# Altium schematic sheet 02_USB2UART.SchDoc
size OrCAD B
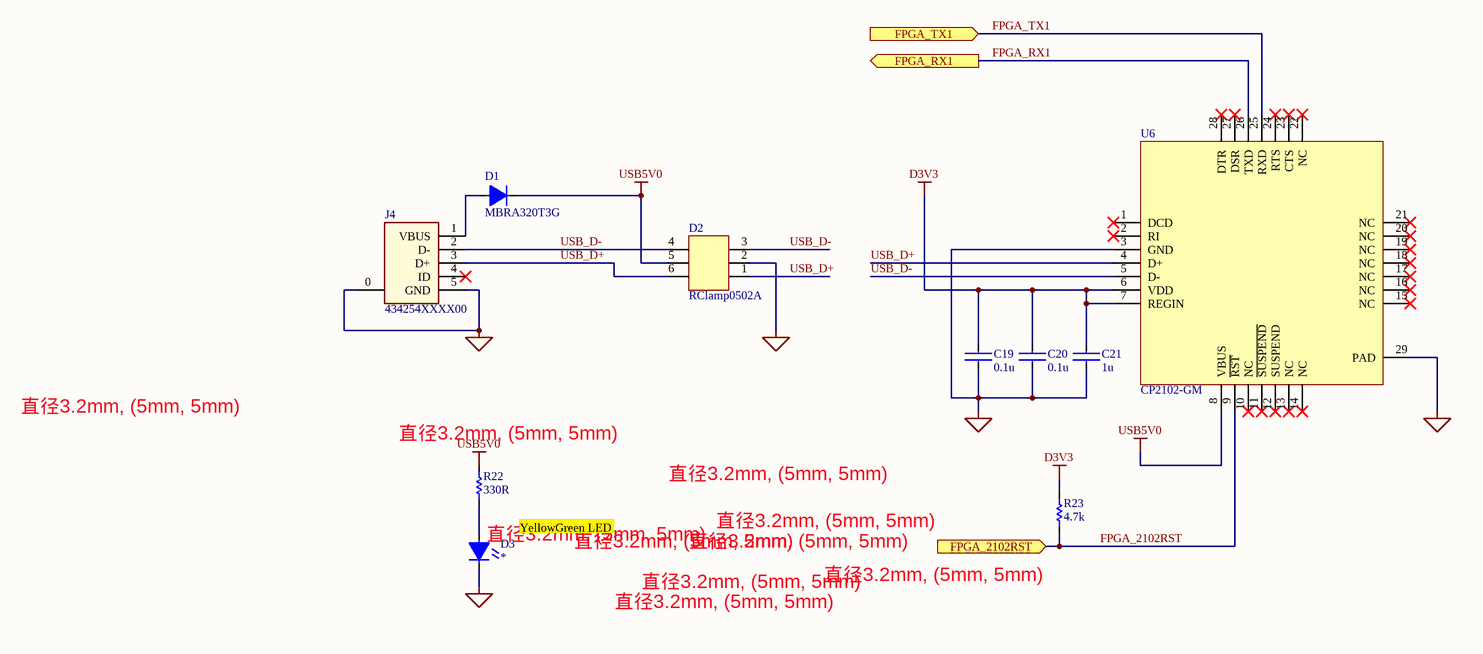
[diagram p0: 02_USB2UART.SchDoc]

## Parts
C19  0.1u  [C0402]
C20  0.1u  [C0402]
C21  1u  [CAPC1608X09N_C0603]
D1  MBRA320T3G  [DIOM4326X23N_SMA]
D2  RClamp0502A  [SOTFL50P162X60-6N_RClamp0502A]
D3  *  [LED0603]
J4  434254XXXX00  [434254XXXX00]
R22  330R  [R0402]
R23  4.7k  [R0402]
U6  CP2102-GM  [QFN50P500X500X100_HS-29N_CP2012GM]

## Ports
FPGA_2102RST (in), FPGA_RX1 (out), FPGA_TX1 (in)

## Nets
D3V3: C19.1 C20.1 C21.1 R23.2 U6.6(VDD) U6.7(REGIN)
GND: C19.2 C20.2 C21.2 D2.2 D3.2(L21) J4.0 J4.5(GND) U6.3(GND) U6.29(PAD)
USB5V0: D1.2(K) D2.5 R22.2 U6.8(VBUS)
FPGA_2102RST: R23.1 U6.9(~{RST}) ; port FPGA_2102RST
FPGA_RX1: U6.26(TXD) ; port FPGA_RX1
FPGA_TX1: U6.25(RXD) ; port FPGA_TX1
USB_D+: D2.1 D2.6 J4.3(D+) U6.4(D+)
USB_D-: D2.3 D2.4 J4.2(D-) U6.5(D-)
NetD1_1: D1.1(A) J4.1(VBUS)
NetD3_1: D3.1(L20) R22.1

Not connected (* = marked no-connect by the designer): J4 4(ID)*; U6 1(DCD)* 2(RI)* 10(NC)* 11(~{SUSPEND})* 12(SUSPEND)* 13(NC)* 14(NC)* 15(NC)* 16(NC)* 17(NC)* 18(NC)* 19(NC)* 20(NC)* 21(NC)* 22(NC)* 23(CTS)* 24(RTS)* 27(DSR)* 28(DTR)*

## Notes on the sheet
- 直径3.2mm, (5mm, 5mm)
- (near R22) 直径3.2mm, (5mm, 5mm)
- (near D3) 直径3.2mm, (5mm, 5mm)
- YellowGreen LED

## Library data of the parts
C19 C20 = CAP011: CAP,Ceramic,X7R,10%,16V,0.1uF,0402; Manufacturer1: *; Manufacturer2: *; PartNumberManufacturer1: *; UnitPrice: *; Value: 0.1u
C21 = CAP12: CAP,Ceramic,X7R,10%,16V,1uF,0603; Manufacturer1: *; Manufacturer2: *; PartNumberManufacturer1: *; UnitPrice: *; Value: 1u
D1 = MBRA320T3G: Schottky Barrier Rectifier,20V,3A,SMA; Manufacturer1: Onsemi; Manufacturer2: Diodes; PartNumberManufacturer2: B320A-13-F; PartNumberManufacturer1: MBRA320T3G; UnitPrice: *
D2 = RClamp0502A: TVS array,0.9pF,5V,SC89; Manufacturer1: SEMTECH; Manufacturer2: *; PartNumberManufacturer1: RClamp0502A; PartNumberManufacturer2: *; UnitPrice: *
D3 = LED YellowGreen0603: LED,Yellow Green,2V,20mA,0603; Manufacturer1: *; PartNumberManufacturer2: *; Manufacturer2: *; PartNumberManufacturer1: *; UnitPrice: *
J4 = 434254XXXX00: Mini-USB Receptacle,5-Pin,0.8mm Pitch,SMD; Manufacturer1: Leyconn; Manufacturer2: *; PartNumberManufacturer1: 434254XXXX00; PartNumberManufacturer2: *; UnitPrice: *
R22 = RES0111: RES,330R,1%,1/16W,0402; Manufacturer1: *; PartNumberManufacturer2: *; Manufacturer2: *; PartNumberManufacturer1: *; Value: 330R; UnitPrice: *
R23 = RES015: RES,4.7k,1%,1/16W,0402; Manufacturer1: *; PartNumberManufacturer2: *; Manufacturer2: *; PartNumberManufacturer1: *; Value: 4.7k; UnitPrice: *
U6 = CP2102-GM: IC,USB to UART bridge,QFN28; Manufacturer1: Silicon Labs; Manufacturer2: *; PartNumberManufacturer1: CP2102-GM; PartNumberManufacturer2: *